# EAGLE design powerstage (EAGLE 9.3.2)
Assembly variants: BASIC
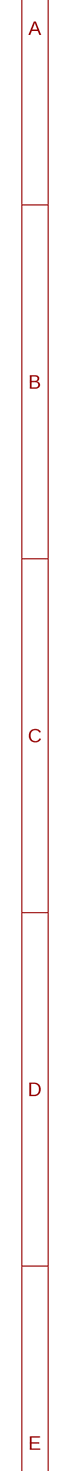
[diagram p0: schematic, sheet 1, part 1 of 2]
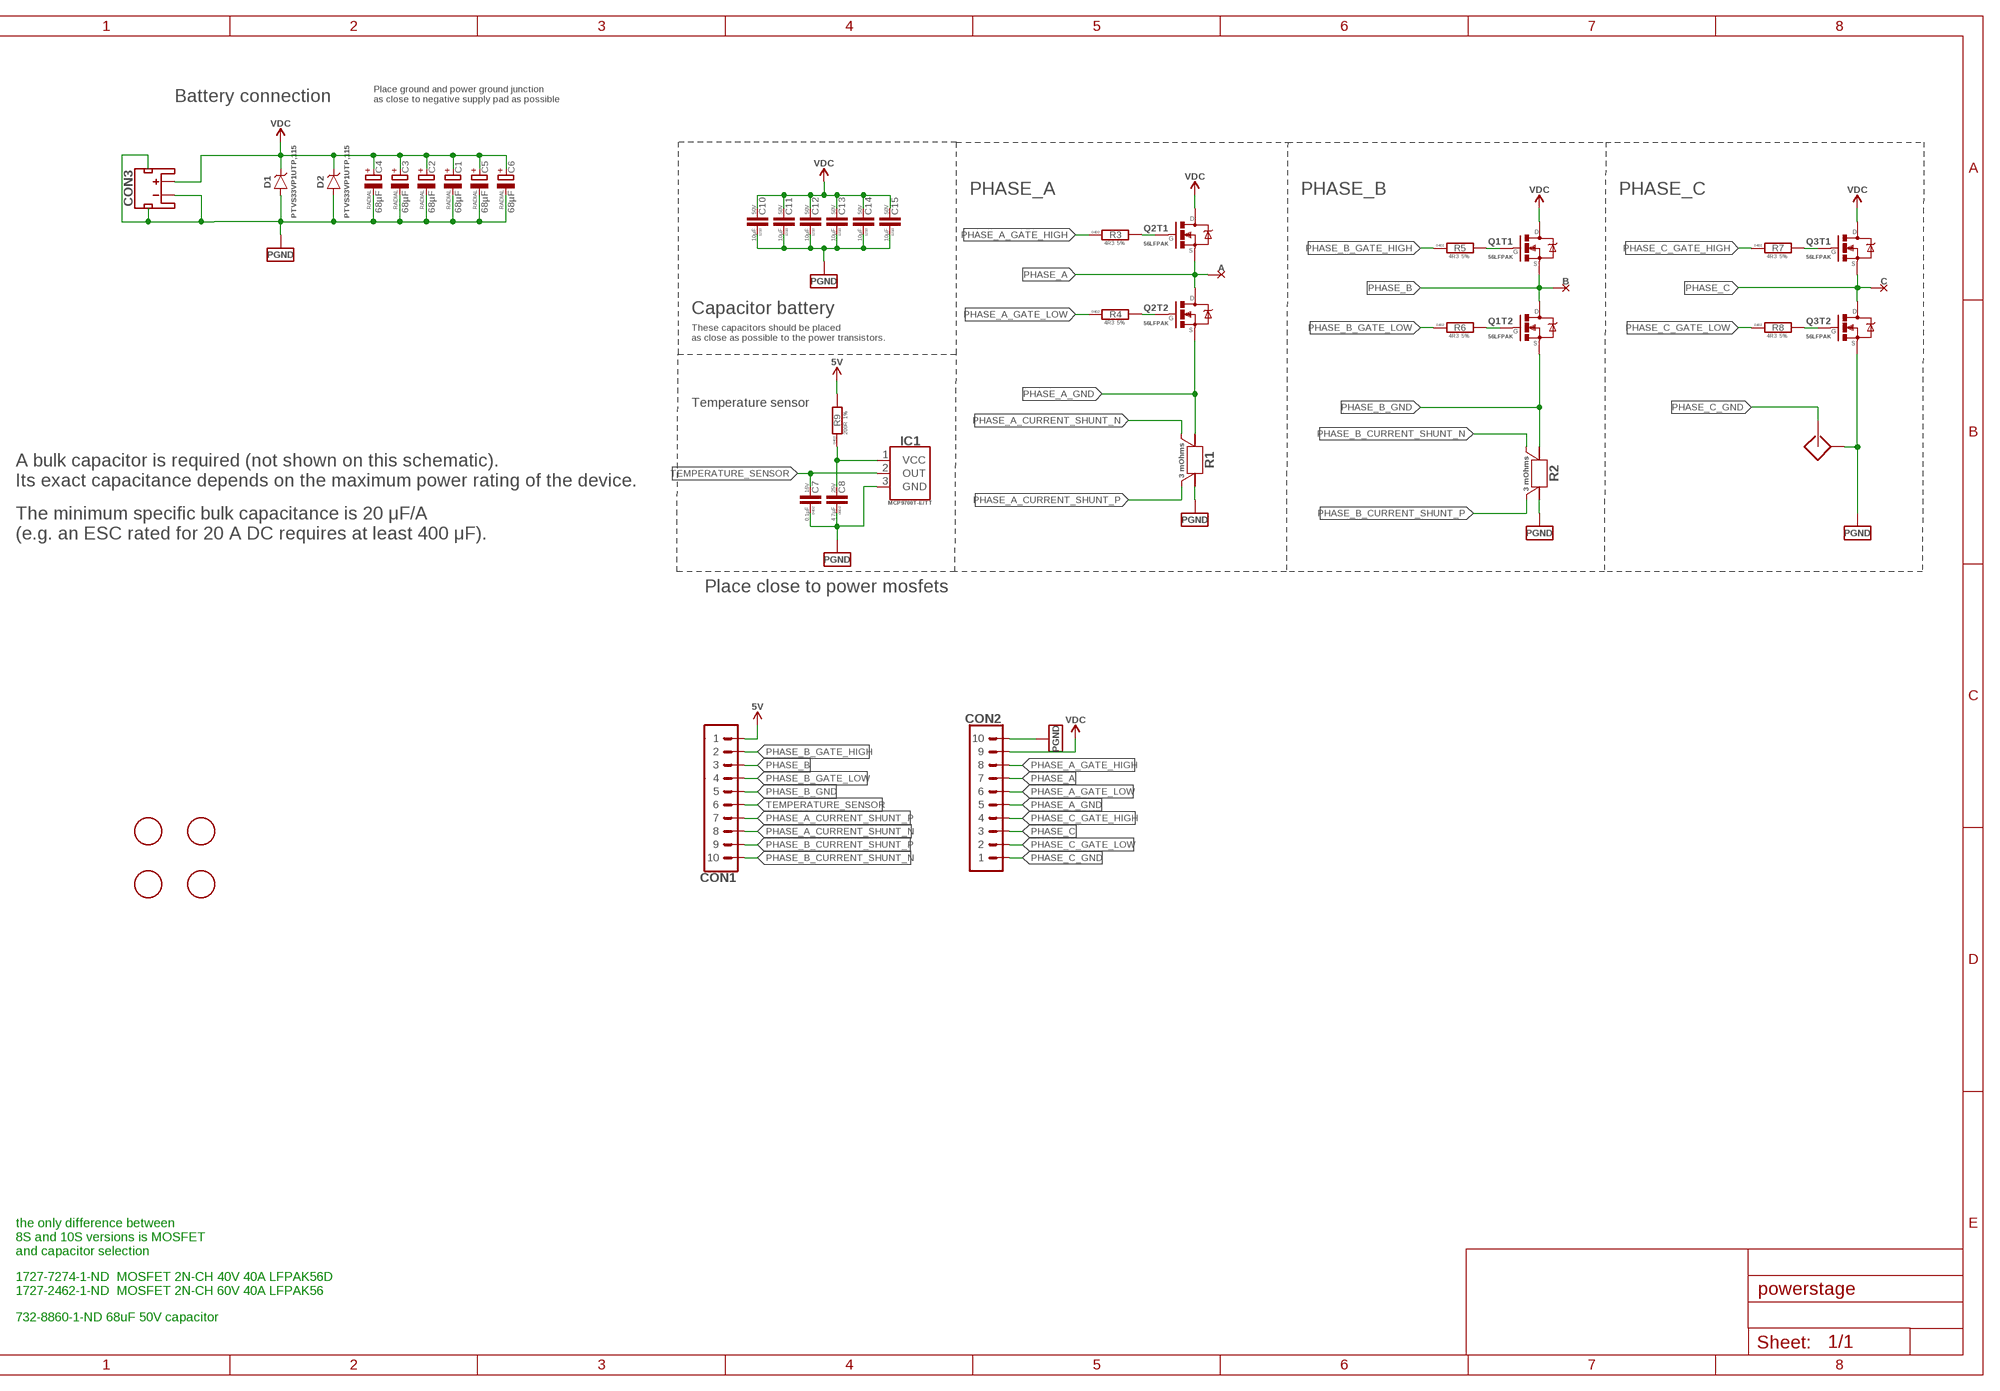
[diagram p1: schematic, sheet 1, part 2 of 2]

## Parts
A  PAD-HOLE_2  [HOLE_2]  (not fitted in variant BASIC)
B  PAD-HOLE_2  [HOLE_2]  (not fitted in variant BASIC)
C  PAD-HOLE_2  [HOLE_2]  (not fitted in variant BASIC)
C1  68µF  CPOL-68UF_50VRADIAL-6.3X12.5-RA  [RADIAL_6.3X12.5-RA]
C2  68µF  CPOL-68UF_50VRADIAL-6.3X12.5-RA  [RADIAL_6.3X12.5-RA]
C3  68µF  CPOL-68UF_50VRADIAL-6.3X12.5-RA  [RADIAL_6.3X12.5-RA]
C4  68µF  CPOL-68UF_50VRADIAL-6.3X12.5-RA  [RADIAL_6.3X12.5-RA]
C5  68µF  CPOL-RADIAL_6.3X12.5  [RADIAL_6.3X12.5]
C6  68µF  CPOL-RADIAL_6.3X12.5  [RADIAL_6.3X12.5]
C7  0.1µF  0.1µF-16V_10%_X7R-0402  [C0402]
C8  4.7µF  4.7µF-25V_10%_X6S-0603  [C0603]
C10  10µF  10µF-50_10%_X7S-C1210  [C1210]
C11  10µF  10µF-50_10%_X7S-C1210  [C1210]
C12  10µF  10µF-50_10%_X7S-C1210  [C1210]
C13  10µF  10µF-50_10%_X7S-C1210  [C1210]
C14  10µF  10µF-50_10%_X7S-C1210  [C1210]
C15  10µF  10µF-50_10%_X7S-C1210  [C1210]
CON1  PINHEAD_1X10-2-FEMALE  [1X10-PTH_2-FEMALE]
CON2  PINHEAD_1X10-2-FEMALE  [1X10-PTH_2-FEMALE]
CON3  BATTERY_CON-2P-XT30-RA  [XT30-RA]
D1  PTVS33VP1UTP,115-36V-SOD128  [SOD128]
D2  PTVS33VP1UTP,115-36V-SOD128  [SOD128]
IC1  MCP9700  [SOT23B-3]
Q1  BUK9K6R2-40E,115  [SOT-1205]
Q2  BUK9K6R2-40E,115  [SOT-1205]
Q3  BUK9K6R2-40E,115  [SOT-1205]
R1  3 mOhms  CURRENT_SHUNT_KELVIN-0.003R-2512-KELVIN  [R2512-KELVIN]
R2  3 mOhms  CURRENT_SHUNT_KELVIN-0.003R-2512-KELVIN  [R2512-KELVIN]
R3  4R3  4R3-5%-0402  [R0402]
R4  4R3  4R3-5%-0402  [R0402]
R5  4R3  4R3-5%-0402  [R0402]
R6  4R3  4R3-5%-0402  [R0402]
R7  4R3  4R3-5%-0402  [R0402]
R8  4R3  4R3-5%-0402  [R0402]
R9  200R  200R-1%-0402  [R0402]
S1  SENSE  [SENSE-0.6]  (not fitted in variant BASIC)
U$8  FIDUCIALMOUNT  [FIDUCIA-MOUNT]  (not fitted in variant BASIC)
U$9  FIDUCIALMOUNT  [FIDUCIA-MOUNT]  (not fitted in variant BASIC)
U$10  FIDUCIALMOUNT  [FIDUCIA-MOUNT]  (not fitted in variant BASIC)
U$12  FIDUCIALMOUNT  [FIDUCIA-MOUNT]  (not fitted in variant BASIC)

## Nets
N$1 [HV]: Q2.2(T1:G) R3.2
N$2: Q2.4(T2:G) R4.2
N$3: Q1.2(T1:G) R5.2
N$4: Q1.4(T2:G) R6.2
N$10: C8.P$2 IC1.1(VCC) R9.1
N$12 [HV]: Q3.2(T1:G) R7.2
N$13: Q3.4(T2:G) R8.2
PGND: C1.- C2.- C3.- C4.- C5.- C6.- C7.1 C8.P$1 C10.1 C11.1 C12.1 C13.1 C14.1 C15.1 CON2.10 CON3.- CON3.P$3(PAD1) CON3.P$4(PAD2) D1.A D2.A IC1.3(GND) Q3.3(T2:S) R1.2 R1.22 R2.2 R2.22 S1.SHELL(SHELLL)
PHASE_A [HV]: A.P$1 CON2.7 Q2.1(T1:S) Q2.5(T2:D) Q2.6(T2:D) Q2.EP-5-6(T2:D)
PHASE_A_CURRENT_SHUNT_N: CON1.8 R1.S1
PHASE_A_CURRENT_SHUNT_P: CON1.7 R1.S2
PHASE_A_GATE_HIGH [HV]: CON2.8 R3.1
PHASE_A_GATE_LOW: CON2.6 R4.1
PHASE_A_GND: CON2.5 Q2.3(T2:S) R1.1 R1.11
PHASE_B [HV]: B.P$1 CON1.3 Q1.1(T1:S) Q1.5(T2:D) Q1.6(T2:D) Q1.EP-5-6(T2:D)
PHASE_B_CURRENT_SHUNT_N: CON1.10 R2.S1
PHASE_B_CURRENT_SHUNT_P: CON1.9 R2.S2
PHASE_B_GATE_HIGH [HV]: CON1.2 R5.1
PHASE_B_GATE_LOW: CON1.4 R6.1
PHASE_B_GND: CON1.5 Q1.3(T2:S) R2.1 R2.11
PHASE_C [HV]: C.P$1 CON2.3 Q3.1(T1:S) Q3.5(T2:D) Q3.6(T2:D) Q3.EP-5-6(T2:D)
PHASE_C_GATE_HIGH [HV]: CON2.4 R7.1
PHASE_C_GATE_LOW: CON2.2 R8.1
PHASE_C_GND: CON2.1 S1.IN
TEMPERATURE_SENSOR: C7.2 CON1.6 IC1.2(OUT)
VDC [HV]: C1.+ C2.+ C3.+ C4.+ C5.+ C6.+ C10.2 C11.2 C12.2 C13.2 C14.2 C15.2 CON2.9 CON3.+ D1.C D2.C Q1.7(T1:D) Q1.8(T1:D) Q1.EP-7-8(T1:D) Q2.7(T1:D) Q2.8(T1:D) Q2.EP-7-8(T1:D) Q3.7(T1:D) Q3.8(T1:D) Q3.EP-7-8(T1:D)
VDD_5V: CON1.1 R9.2 ; supply symbol labelled 5V

## Notes on the sheet
- Battery connection
- Place ground and power ground junction
  as close to negative supply pad as possible
- PHASE_A | PHASE_B | PHASE_C
- Capacitor battery
- These capacitors should be placed 
  as close as possible to the power transistors.
- Temperature sensor
- A bulk capacitor is required (not shown on this schematic).
  Its exact capacitance depends on the maximum power rating of the device.
- The minimum specific bulk capacitance is 20 μF/A 
  (e.g. an ESC rated for 20 A DC requires at least 400 μF).
- Place close to power mosfets
- the only difference between 
  8S and 10S versions is MOSFET 
  and capacitor selection
- 1727-7274-1-ND  MOSFET 2N-CH 40V 40A LFPAK56D
  1727-2462-1-ND  MOSFET 2N-CH 60V 40A LFPAK56
- 732-8860-1-ND 68uF 50V capacitor

## Library data of the parts
A B C = PADS:PAD; BOM: EXCLUDE
C1-C4 = rc:CPOL: Polar tantalum capacitor; DIA: 6.3mm; DIGIKEY#: 732-8860-1-ND; HEIGHT: 12.5mm; MANF: Wurth Electronics Inc; MANF#: 860020673014; PACKAGE: RADIAL; TOLERANCE: ±20%; VOLTAGE: 50V
C5 C6 = rc:CPOL: Polar tantalum capacitor; DIGIKEY#: 732-8860-1-ND; PACKAGE: RADIAL
C7 = C_digikey:0.1µF; DIGIKEY#: 490-3261-1-ND; MANF: Murata Electronics North America; MANF#: GRM155R71C104KA88D; OPERATING_TEMP: -55°C ~ 125°C; PACKAGE: 0402; TC: X7R; TOLERANCE: +-10%; VOLTAGE: 16V
C8 = C_digikey:4.7µF; DIGIKEY#: 490-7199-1-ND; MANF: Murata Electronics North America; MANF#: GRM188C81E475KE11D; OPERATING_TEMP: -55°C ~ 105°C; PACKAGE: 0603; TC: X6S; TOLERANCE: +-10%; VOLTAGE: 25V
C10-C15 = C_digikey:10µF; DIGIKEY#: 445-7004-1-ND; MANF: TDK Corporation; MANF#: CGA6P3X7S1H106K250AB; PACKAGE: 1210; TC: X7S; TOLERANCE: ±10%; VOLTAGE: 50V
CON1 CON2 = pinhead:PINHEAD_1X10; DIGIKEY#: S5751-10-ND; MANF: Sullins Connector Solutions; MANF#: NPPN101BFCN-RC
CON3 = Connectors:BATTERY_CON-2P; LINK: https://www.tme.eu/en/details/xt30pw-m/dc-power-connectors/amass/; MANF: AMASS; MANF#: XT30PW-M
D1 D2 = TVS_diodes:PTVS33VP1UTP,115: 53.3V Clamp 11.3A Ipp Tvs Diode Surface Mount CFP5; DIGIKEY#: 1727-1411-1-ND; MANF: Nexperia USA Inc; MANF#: PTVS33VP1UTP,115
IC1 = myxa_masterlib:MCP9700: SENSOR TEMP ANLG VOLT SOT-23-3; DIGIKEY#: MCP9700T-E/TTTR-ND; MANF: Microchip Technology; MANF#: MCP9700T-E/TT
Q1-Q3 = mosfet:BUK9K6R2-40E,115: Mosfet Array 2 N-Channel (Dual) 40V 40A 68W Surface Mount LFPAK56D; DIGIKEY#: 1727-7274-1-ND; MANF: NXP Semiconductors; MANF#: BUK9K6R2-40E,115; PACKAGE: 56LFPAK
R1 R2 = SHUNT_RESISTORS:CURRENT_SHUNT_KELVIN; DIGIKEY#: CSNL2512FT3L00CT-ND; MANF: Stackpole Electronics Inc.; MANF#: CSNL2512FT3L00; POWER: 2W; TC: ±50ppm/°C; TOLERANCE: ±1%
R3-R8 = R_digikey:4R3; DIGIKEY#: 311-4.3JRCT-ND; MANF: Yageo; MANF#: RC0402JR-074R3L; PACKAGE: 0402; TOLERANCE: 5%
R9 = R_digikey:200R; DIGIKEY#: 311-200LRCT-ND; MANF: Yageo; MANF#: RC0402FR-07200RL; PACKAGE: 0402; TOLERANCE: 1%
S1 = misc:SENSE; BOM: EXCLUDE
U$8-U$10 U$12 = usb2can_master_lib:FIDUCIALMOUNT

## Net classes
1 HV: clearance 0.25 mm to class 0, clearance 0.25 mm

## Board
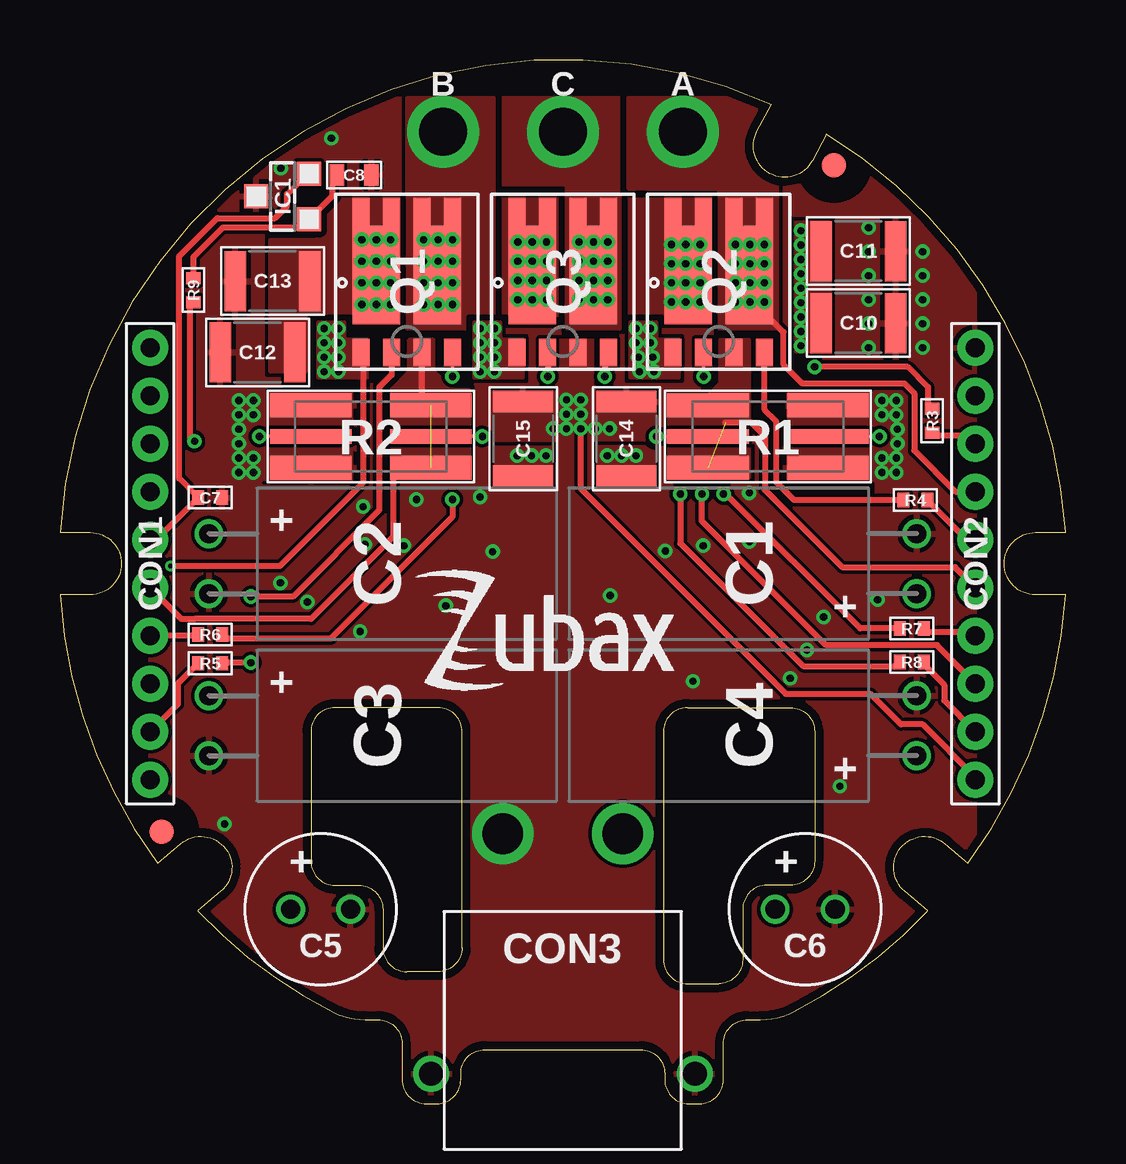
[diagram p2: board, top side]
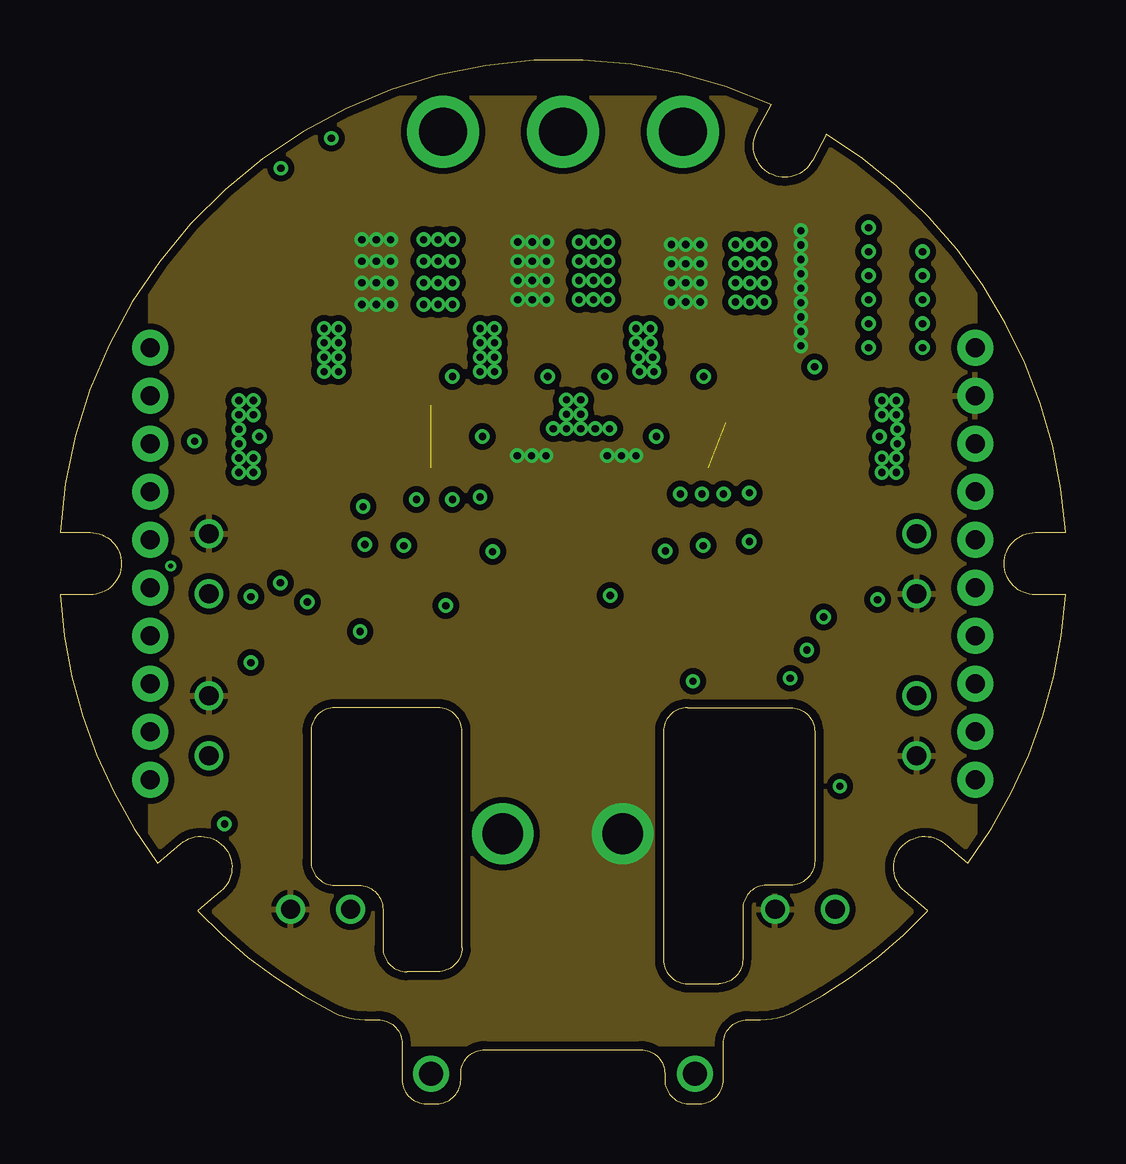
[diagram p3: board, inner layer Route2]
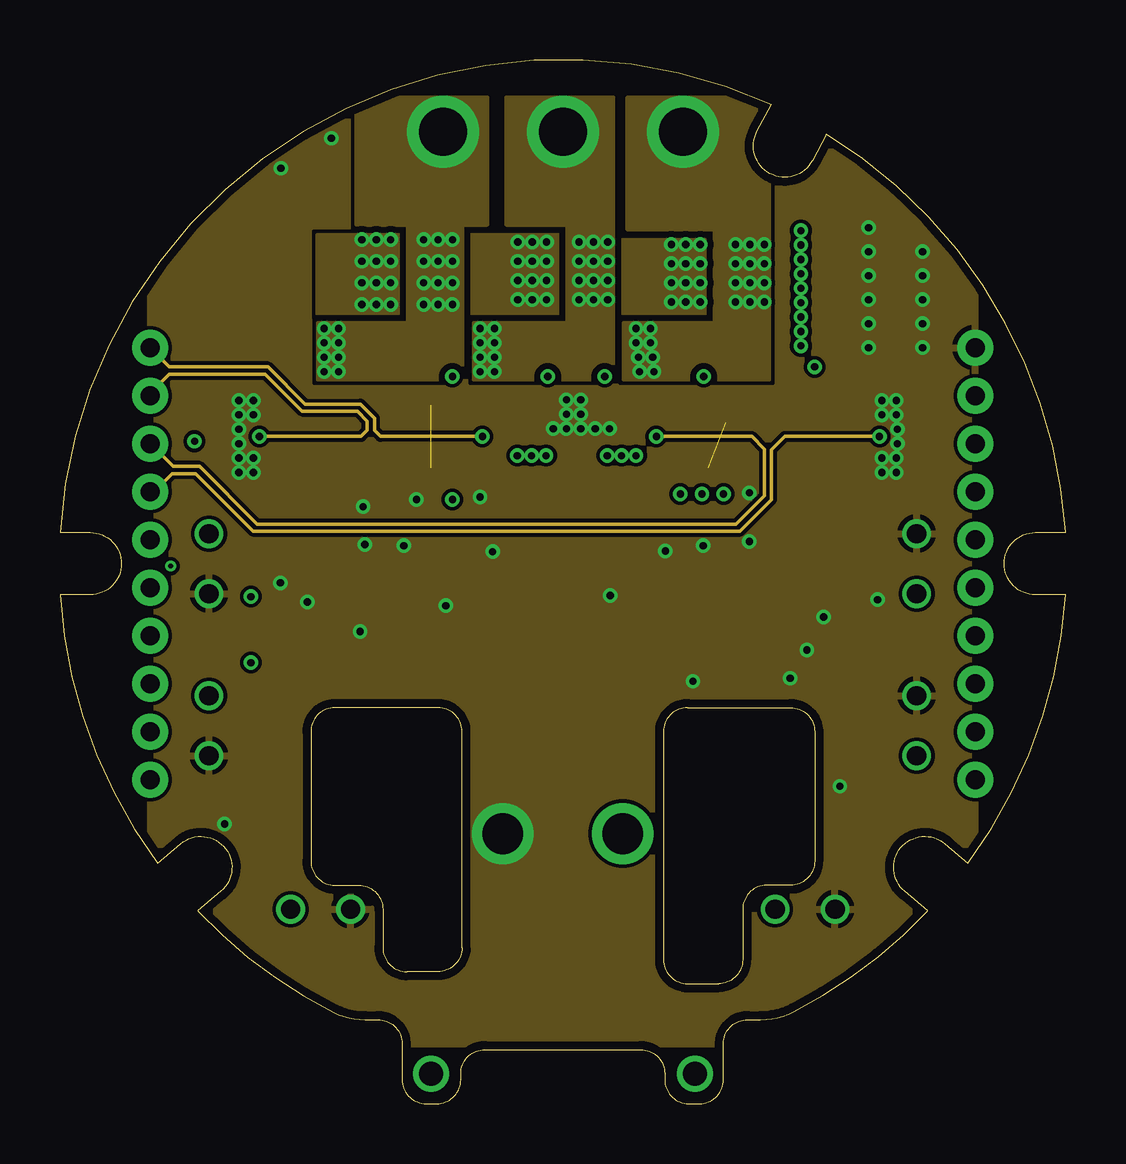
[diagram p4: board, inner layer Route15]
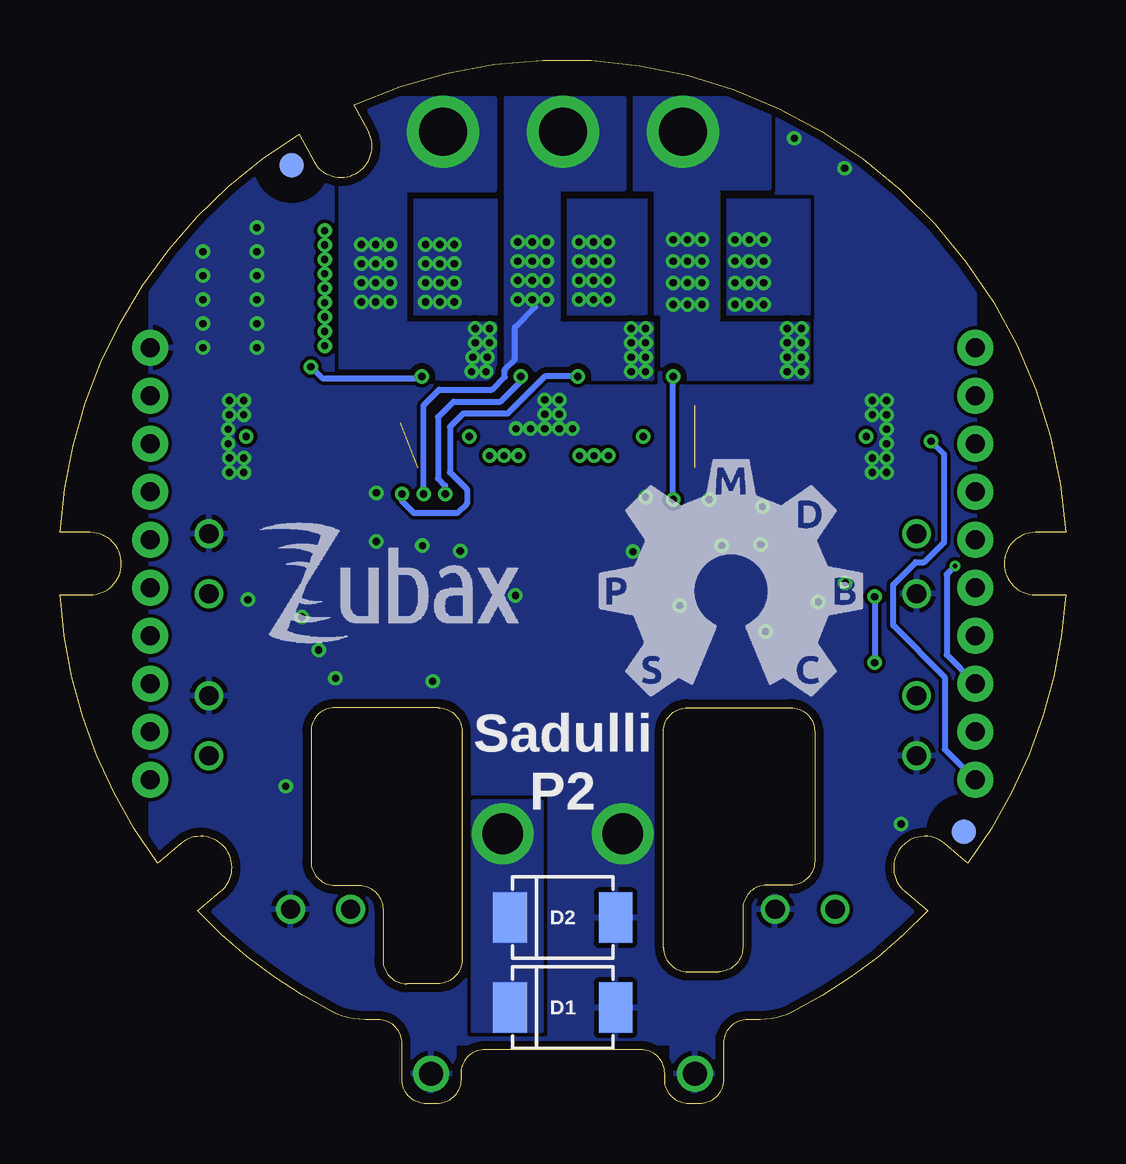
[diagram p5: board, bottom side, seen from below]

Size 41.92 x 43.48 mm. Coordinates in mm from the lower left corner, seen from the top.
Outline: 6.7,8.84 5.74,8.03 arc19 11.41,3.8 arc26 12.71,3.5 13.26,3.5 arc-90 14.26,2.5 14.26,1 arc90 15.26,0 15.71,0 arc90 16.71,1 16.71,1.25 arc-90 17.71,2.25 24.21,2.25 arc-90 25.21,1.25 25.21,1 arc90 26.21,0 26.66,0 arc90 27.66,1 27.66,2.5 arc-90 28.66,3.5 29.21,3.5 arc27 30.58,3.83 arc19 36.18,8.03 35.21,8.84 arc-180 36.89,10.83 37.85,10.02 arc33 41.92,21.2 40.66,21.2 arc-180 40.66,23.8 41.92,23.8 arc55 31.95,40.4 31.36,39.28 arc-180 29.06,40.5 29.65,41.62 arc111 0,23.8 1.26,23.8 arc-180 1.26,21.2 0,21.2 arc33 4.07,10.02 5.03,10.83 arc-180 6.7,8.84
Outline: 13.46,8.1 13.46,6.5 arc90 14.46,5.5 15.76,5.5 arc90 16.76,6.5 16.76,15.5 arc90 15.76,16.5 11.46,16.5 arc90 10.46,15.5 10.46,10.1 arc90 11.46,9.1 12.46,9.1 arc-90 13.46,8.1
Outline: 28.46,8.1 28.46,6 arc-90 27.46,5 26.16,5 arc-90 25.16,6 25.16,15.5 arc-90 26.16,16.5 30.46,16.5 arc-90 31.46,15.5 31.46,10.1 arc-90 30.46,9.1 29.46,9.1 arc90 28.46,8.1
Copper layers (1*2*15*16): Top 0.035mm / dielectric 0.5mm / Route2 0.035mm / dielectric 0.5mm / Route15 0.035mm / dielectric 0.5mm / Bottom 0.035mm
Design rules "myxa *": minimum track width 0.15mm, minimum drill 0.2mm, track to track 0.15mm, track to pad 0.15mm, pad to pad 0.15mm, via to via 0.15mm, smd to smd 0.15mm, copper to edge 0.35mm, drill to drill 0.2mm, minimum pad ring 0.125mm, minimum via ring 0.125mm, stop-mask expansion 1mil, vias tented up to drill 0.31mm, thermal gap 8mil
tRestrict: 8 lines

### Footprints (pad centres in the part's own frame; a part is rotated, then mirrored left to right if it is on the bottom)
HOLE_2 = drill 2 pad 2.7: P$1 0,0
RADIAL_6.3X12.5-RA = drill 0.8: + -1.25,0; - 1.25,0
RADIAL_6.3X12.5 = drill 0.8: + -1.25,0; - 1.25,0
C0402 = smd 0.5 x 0.6: 1 -0.5,0; 2 0.5,0
C0603 = smd 0.6 x 0.9: P$1 -0.725,0; P$2 0.725,0
C1210 = smd 0.9 x 2.5: 1 -1.55,0; 2 1.55,0
1X10-PTH_2-FEMALE = drill 0.8 pad 1.5: 1 -9,0; 2 -7,0; 3 -5,0; 4 -3,0; 5 -1,0; 6 1,0; 7 3,0; 8 5,0; 9 7,0; 10 9,0
XT30-RA = drill 1.7: + -2.5,0; - 2.5,0 | drill 1: P$3 -5.5,10; P$4 5.5,10
SOD128 = smd 1.4 x 2.1: A -2.2,0; C 2.2,0
SOT23B-3 = smd 1 x 1: 1 -0.95,-1.1; 2 0.95,-1.1; 3 0,1.1
SOT-1205 = smd 1.15 x 0.7: 1 -2.95,1.905; 2 -2.95,0.635; 3 -2.95,-0.635; 4 -2.95,-1.905 | smd 1.9 x 0.7: 5 2.553,-1.905; 6 2.553,-0.635; 7 2.553,0.635; 8 2.553,1.905 | smd 4.1 x 1.97: EP-5-6 0.27,-1.27; EP-7-8 0.27,1.27
R2512-KELVIN = smd 3.4 x 1: 1 -2.5,1.3; 2 2.5,1.3; 11 -2.5,-1.3; 22 2.5,-1.3 | smd 3.4 x 0.6: S1 -2.5,0; S2 2.5,0
R0402 = smd 0.5 x 0.6: 1 -0.5,0; 2 0.5,0
SENSE-0.6 = smd 0.1 x 0.1: IN 0,0 | drill 0.3 pad 0.6: SHELL 0,0
FIDUCIA-MOUNT = smd 1.016 x 1.016: P$1 0,0

### Placement (x,y rotation side)
A  25.96,40.5 0 top
B  15.96,40.5 0 top
C  20.96,40.5 0 top
C1  35.71,22.5 90 top
C2  6.21,22.5 270 top
C3  6.21,15.75 270 top
C4  35.71,15.75 90 top
C5  10.86,8.1 0 top
C6  31.06,8.1 0 top
C7  6.26,25.25 180 top
C8  12.26,38.7 180 top
C10  33.28,32.52 180 top
C11  33.28,35.52 180 top
C12  8.23,31.3 0 top
C13  8.86,34.27 0 top
C14  23.61,27.7 270 top
C15  19.31,27.7 270 top
CON1  3.76,22.5 90 top
CON2  38.16,22.5 90 top
CON3  20.96,11.25 180 top
D1  20.96,4 180 bottom
D2  20.96,7.75 180 bottom
IC1  9.28,37.8 90 top
Q1  14.46,34.25 90 top
Q2  27.46,34.25 90 top
Q3  20.96,34.25 90 top
R1  29.51,27.8 0 top
R2  12.96,27.8 180 top
R3  36.36,28.45 90 top
R4  35.66,25.15 180 top
R5  6.26,18.35 0 top
R6  6.26,19.55 0 top
R7  35.51,19.8 180 top
R8  35.51,18.4 180 top
R9  5.56,33.9 270 top
S1  21.71,28.12 90 top
U$1  [ZUBAX_LOGO_5X10]  33.66,19 0 bottom
U$2  [DUCK_6X5]  17.96,2.5 0 top
U$4  [OSHW-10.5X11.5]  19.43,16.98 0 bottom
U$8  4.23,11.32 0 bottom
U$9  32.26,39.1 0 bottom
U$10  32.26,39.1 0 top
U$12  4.23,11.32 0 top
U$13  [ZUBAX_LOGO_5X10]  14.73,17.02 0 top

### Tracks (layer width: path | path; a pad name or v marks a point on that pad's centre or on a via)
N$1  (via drill 0.3 pad 0.6)
  Top 0.152: Q2.2 26.82,30.31 v26.83,30.3
  Top 0.25: R3.2 36.18,29.12 36.18,29.85 35.33,30.7 v31.46,30.7
  Bottom 0.25: v26.83,30.3 26.91,30.23 30.98,30.23 v31.46,30.7
N$2
  Top 0.25: R4.2 30.61,25.15 29.86,25.9 29.86,28.43 29.36,28.92 Q2.4
N$3  (via drill 0.3 pad 0.6)
  Top 0.25: Q1.2 13.82,30.37 13.31,29.85 13.31,24.73 9.71,21.12 v7.96,21.12 | v7.96,18.38 6.78,18.38 R5.2
  Bottom 0.25: v7.96,21.12 v7.96,18.38
N$4  (via drill 0.3 pad 0.6)
  Top 0.152: Q1.4 v16.36,30.3
  Top 0.25: v16.36,25.18 16.36,24.45 11.28,19.38 6.93,19.38 R6.2
  Bottom 0.25: v16.36,25.18 v16.36,30.3
N$10
  Top 0.25: C8.P$2 11.36,38.67 11.36,37.83 IC1.1 10.38,36.5 6.78,36.5 5.56,35.27 R9.1
N$12  (via drill 0.3 pad 0.6)
  Top 0.25: R7.2 33.36,19.8 27.76,25.4 v27.66,25.4 | Q3.2 20.33,31.29 v20.33,30.3
  Bottom 0.25: v20.33,30.3 21.71,30.3 23.26,28.75 25.11,28.75 25.66,28.2 25.66,26.3 24.96,25.6 24.96,25 25.36,24.6 27.16,24.6 27.66,25.1 v27.66,25.4
N$13  (via drill 0.3 pad 0.6)
  Top 0.25: v25.86,25.4 25.86,23.34 30.98,18.23 34.83,18.23 R8.2 | Q3.4 22.71,31.14 v22.71,30.3
  Bottom 0.25: v25.86,25.4 25.86,25.75 26.16,26.05 26.16,28.6 25.51,29.25 23.56,29.25 22.71,30.1 v22.71,30.3
PGND  (via drill 0.3 pad 0.6)
  other vias: 34.26,29.3 34.26,28.7 34.26,26.9 34.26,26.3 34.86,29.3 34.86,28.7 34.91,28.1 34.91,27.5 34.86,26.9 34.86,26.3 8.06,26.3 8.06,26.9 8.06,28.7 8.06,29.3 7.46,26.3 7.46,26.9 7.46,27.5 7.46,28.1 7.46,28.7 7.46,29.3 21.11,29.32 21.71,29.32 21.11,28.73 21.71,28.73 21.11,28.12 20.56,28.12 22.31,28.12 22.91,28.12 9.21,38.98 11.31,40.23 33.71,36.5 33.71,35.5 33.71,34.5 33.71,33.5 33.71,32.5 33.71,31.5 35.96,35.5 35.96,34.5 35.96,33.5 35.96,32.5 35.96,31.5 14.86,25.18 10.31,20.9 12.51,19.68 28.73,23.43 31.83,20.27 34.08,21 28.73,25.45 25.23,23.02 30.43,17.73 26.81,23.25 31.13,18.9 16.08,20.75 26.38,17.6 6.86,11.65 32.51,13.22 22.93,21.18 18.03,23 17.51,25.27 9.18,21.7 12.63,24.88 12.71,23.3 14.33,23.25
  pour Bottom (rank 5): 38.16,41.9 3.76,41.9 3.76,2.5 14.21,2.5 14.21,0.5 16.46,0.5 16.46,2.5 25.46,2.5 25.46,0.5 27.71,0.5 27.71,2.5 38.16,2.5
  pour Top (no thermals): 30.38,29.6 35.33,29.6 35.33,26 30.38,26
  pour Top (no thermals): 12.16,26 7.23,26 7.23,29.6 12.16,29.6
  pour Top (no thermals): 22.26,31.8 20.88,31.8 20.88,29.65 17.66,29.65 17.66,27.95 24.81,27.95 24.81,29.65 22.26,29.65
  pour Top (rank 5): 3.76,41.9 38.16,41.9 38.16,0 3.76,0
  pour Route15 (rank 5): 3.76,41.9 3.76,2.5 38.16,2.5 38.16,41.9
PHASE_A  (via drill 0.3 pad 0.6)
  Top 0.152: Q2.1 25.55,31.7
  Top 0.25: Q2.EP-5-6 28.73,33.58 30.16,32.15 30.16,30.8 30.95,30 35.21,30 35.61,29.6 35.61,27.22 37.33,25.5 CON2.7
  other vias: 24.61,32.3 24.61,31.7 24.71,31.1 24.11,31.1 24.01,31.7 24.01,32.3 24.76,30.5 24.16,30.5 28.16,35.8 28.76,35.8 29.36,35.8 28.16,35 28.76,35 29.36,35 28.16,34.2 28.76,34.2 29.36,34.2 28.16,33.4 28.76,33.4 29.36,33.4
  pour Top (no thermals): 27.51,32.3 27.51,38.15 23.71,38.15 23.71,41.9 29.86,41.9 29.86,32.3
  pour Top (no thermals): 25.81,31.85 24.86,31.85 24.86,32.55 23.76,32.55 23.76,30.25 25.81,30.25
  pour Bottom (no thermals): 23.81,32.5 23.81,30.2 30.21,30.2 30.21,41.9 23.81,41.9 23.81,38.05 27.56,38.05 27.56,32.5
  pour Route15 (no thermals): 23.51,32.5 23.51,30.2 29.56,30.2 29.56,41.9 23.66,41.9 23.66,36.45 27.31,36.45 27.31,32.5
PHASE_A_CURRENT_SHUNT_N  (via drill 0.3 pad 0.6)
  Top 0.15: R1.S1 v24.86,27.8
  Route15 0.15: v24.86,27.8 28.83,27.8 29.36,27.27 29.36,25.34 28.17,24.15 8.22,24.15 5.82,26.55 4.71,26.55 CON1.8
PHASE_A_CURRENT_SHUNT_P  (via drill 0.3 pad 0.6)
  Top 0.15: R1.S2 v34.16,27.8
  Route15 0.15: v34.16,27.8 30.21,27.8 29.66,27.25 29.66,25.16 28.35,23.85 8.05,23.85 5.65,26.24 4.68,26.24 3.93,25.5 CON1.7
PHASE_A_GATE_HIGH
  Top 0.25: CON2.8 37.83,27.82 36.48,27.82 R3.1
PHASE_A_GATE_LOW
  Top 0.25: CON2.6 37.96,23.5 | 37.96,23.5 37.81,23.5 | R4.1 37.81,23.5 | 37.81,23.5 37.96,23.5
PHASE_A_GND  (1 unrouted)
  Top 0.25: 27.73,28.38 28.82,28.38 29.38,27.81 29.38,25.57 32.61,22.35 37.31,22.35 CON2.5
  pour Top (no thermals): 28.73,31.82 27.51,31.82 27.51,30.02 27.01,29.52 25.38,29.52 25.38,26.07 28.73,26.07
PHASE_B  (via drill 0.2, 0.3 pad 0.6)
  Top 0.25: Q1.1 12.63,31.23 12.63,25.87 9.16,22.4 v4.61,22.4
  Bottom 0.25: v4.61,22.4 4.96,22.05 4.96,18.7 CON1.3
  other vias: 11.61,32.3 11.61,31.7 11.61,31.1 11.01,31.1 11.01,31.7 11.01,32.3 11.61,30.5 11.01,30.5 15.16,36 15.76,36 16.36,36 15.16,35.1 15.76,35.1 16.36,35.1 15.16,34.2 15.76,34.2 16.36,34.2 15.16,33.3 15.76,33.3 16.36,33.3
  pour Top (rank 2, no thermals): 14.51,32.3 14.51,41.9 18.06,41.9 18.06,32.3
  pour Top (no thermals): 12.81,31.85 11.86,31.85 11.86,32.55 10.76,32.55 10.76,30.25 12.81,30.25
  pour Bottom (rank 2, no thermals): 10.76,32.5 10.76,30.2 17.06,30.2 17.06,38.1 17.96,38.1 17.96,41.9 12.36,41.9 12.36,38.15 14.51,38.15 14.51,32.5
  pour Route15 (no thermals): 10.76,32.5 10.76,30.2 16.76,30.2 16.76,36.65 17.81,36.65 17.81,41.9 12.36,41.9 12.36,36.65 14.51,36.65 14.51,32.5
PHASE_B_CURRENT_SHUNT_N  (via drill 0.3 pad 0.6)
  Top 0.15: R2.S1 v17.61,27.8
  Route15 0.15: v17.61,27.8 13.36,27.8 13.11,28.05 13.11,28.56 12.52,29.15 10.22,29.15 8.67,30.7 4.56,30.7 CON1.10
PHASE_B_CURRENT_SHUNT_P  (via drill 0.3 pad 0.6)
  Top 0.15: R2.S2 v8.31,27.8
  Route15 0.15: v8.31,27.8 12.56,27.8 12.81,28.05 12.81,28.44 12.4,28.85 10.1,28.85 8.55,30.4 4.56,30.4 3.76,29.6 CON1.9
PHASE_B_GATE_HIGH
  Top 0.25: R5.1 4.91,17.5 4.91,16.65 CON1.2
PHASE_B_GATE_LOW
  Top 0.25: R6.1 5.71,19.5 CON1.4
PHASE_B_GND  (1 unrouted)
  Top 0.25: R2.11 15.09,29.46 Q1.3 | R2.1 14.33,26.5 13.88,26.05 13.88,23.62 10.46,20.2 5.61,20.2 5.06,20.2 CON1.5
  pour Top (no thermals): 15.56,31.8 14.56,31.8 14.56,30.48 13.86,29.77 13.86,26.1 17.06,26.1 17.06,29.7 16.36,29.7 15.56,30.5
PHASE_C  (via drill 0.3 pad 0.6)
  Top 0.25: CON2.3 36.56,19.1 31.93,19.1 26.76,24.27 v26.76,25.4
  Bottom 0.25: v26.76,25.4 26.76,29.1 26.11,29.75 23.92,29.75 23.38,30.28 23.38,30.58 22.96,31.01 22.96,32.35 22.11,33.2 22.23,33.33 v22.23,33.5
  other vias: 21.63,35.9 22.23,35.9 22.83,35.9 21.63,35.1 22.23,35.1 22.83,35.1 21.63,34.3 22.23,34.3 22.83,34.3 21.63,33.5 18.11,32.3 18.11,31.7 18.11,31.1 17.51,31.1 17.51,31.7 17.51,32.3 18.11,30.5 17.51,30.5 22.83,33.5
  pour Top (rank 3, no thermals): 21.16,32.3 21.16,38.3 18.46,38.3 18.46,41.9 23.31,41.9 23.31,32.3
  pour Top (no thermals): 19.31,31.85 18.36,31.85 18.36,32.55 17.26,32.55 17.26,30.25 19.31,30.25
  pour Bottom (no thermals): 17.26,32.5 17.26,30.2 23.31,30.2 23.31,41.9 18.41,41.9 18.41,38.1 21.16,38.1 21.16,32.5
  pour Route15 (no thermals): 17.26,32.5 17.26,30.2 23.06,30.2 23.06,41.9 18.61,41.9 18.61,36.65 21.16,36.65 21.16,32.5
PHASE_C_GATE_HIGH
  Top 0.25: CON2.4 38.16,19.65 36.16,19.65 R7.1
PHASE_C_GATE_LOW
  Top 0.25: R8.1 36.01,18.3 36.86,17.45 36.86,16.8 CON2.2
PHASE_C_GND
  Top 0.25: S1.IN 21.71,25.62 30.26,17.07 33.78,17.07 35.06,15.8 35.96,15.8 38.16,13.6 CON2.1
TEMPERATURE_SENSOR
  Top 0.25: CON1.6 4.01,23.5 C7.2 4.96,26.05 4.96,35.3 6.56,36.9 8.96,36.9 9.46,37.4 9.46,37.9 10.31,38.75 IC1.2
VDC  (via drill 0.3 pad 0.6)
  Top 0.15: Q3.EP-7-8 v19.69,34.3 v19.68,34.3
  other vias: 12.58,36 13.18,36 13.78,36 12.58,35.1 13.18,35.1 13.78,35.1 12.58,34.2 13.18,34.2 13.78,34.2 12.58,33.3 13.18,33.3 13.78,33.3 19.08,35.9 19.68,35.9 20.28,35.9 19.08,35.1 19.68,35.1 20.28,35.1 19.08,34.3 20.28,34.3 19.08,33.5 19.68,33.5 20.28,33.5 25.48,35.8 26.08,35.8 26.68,35.8 25.48,35 26.08,35 26.68,35 25.48,34.2 26.08,34.2 26.68,34.2 25.48,33.4 26.08,33.4 26.68,33.4 30.88,36.38 30.88,35.77 30.88,35.17 30.88,34.58 30.88,33.98 30.88,33.38 30.88,32.77 30.88,32.17 30.88,31.57 19.06,27 19.66,27 20.26,27 22.81,27 23.41,27 24.01,27
  pour Bottom (rank 3): 27.21,37.65 10.71,37.65 10.71,32.85 27.21,32.85
  pour Top (no thermals): 32.08,36.73 30.68,36.73 30.68,31.32 32.08,31.32
  pour Route2: 3.76,41.9 3.76,2.5 38.16,2.5 38.16,41.9
  pour Top (no thermals): 18.16,27.35 18.16,25.75 20.48,25.75 20.48,27.35
  pour Top (no thermals): 22.43,27.38 22.43,25.77 24.78,25.77 24.78,27.38
  pour Bottom (no thermals): 24.68,3.07 21.86,3.07 21.86,12.55 24.68,12.55
  pour Top (rank 2, no thermals): 13.86,36 8.76,36 8.76,30.5 10.26,30.5 10.26,33 13.86,33
  pour Route15 (rank 3): 26.91,36 23.06,36 23.06,36.2 10.71,36.2 10.71,32.85 26.91,32.85
  pour Top (rank 4, no thermals): 27.06,37.67 10.71,37.67 10.71,32.85 27.06,32.85
VDD_5V  (via drill 0.3 pad 0.6)
  Top 0.25: R9.2 5.41,33.25 5.41,27.75 5.56,27.6 v5.61,27.6
  Bottom 0.25: v5.61,27.6 5.06,27.05 5.06,23.4 5.9,22.56 6.25,22.56 7.18,21.62 7.18,19.93 5.03,17.77 5.03,14.78 CON1.1

### Text on the board
bPlace: Sadulli / P2